# EAGLE design OxyBrain V1.2 (EAGLE 9.6.2)
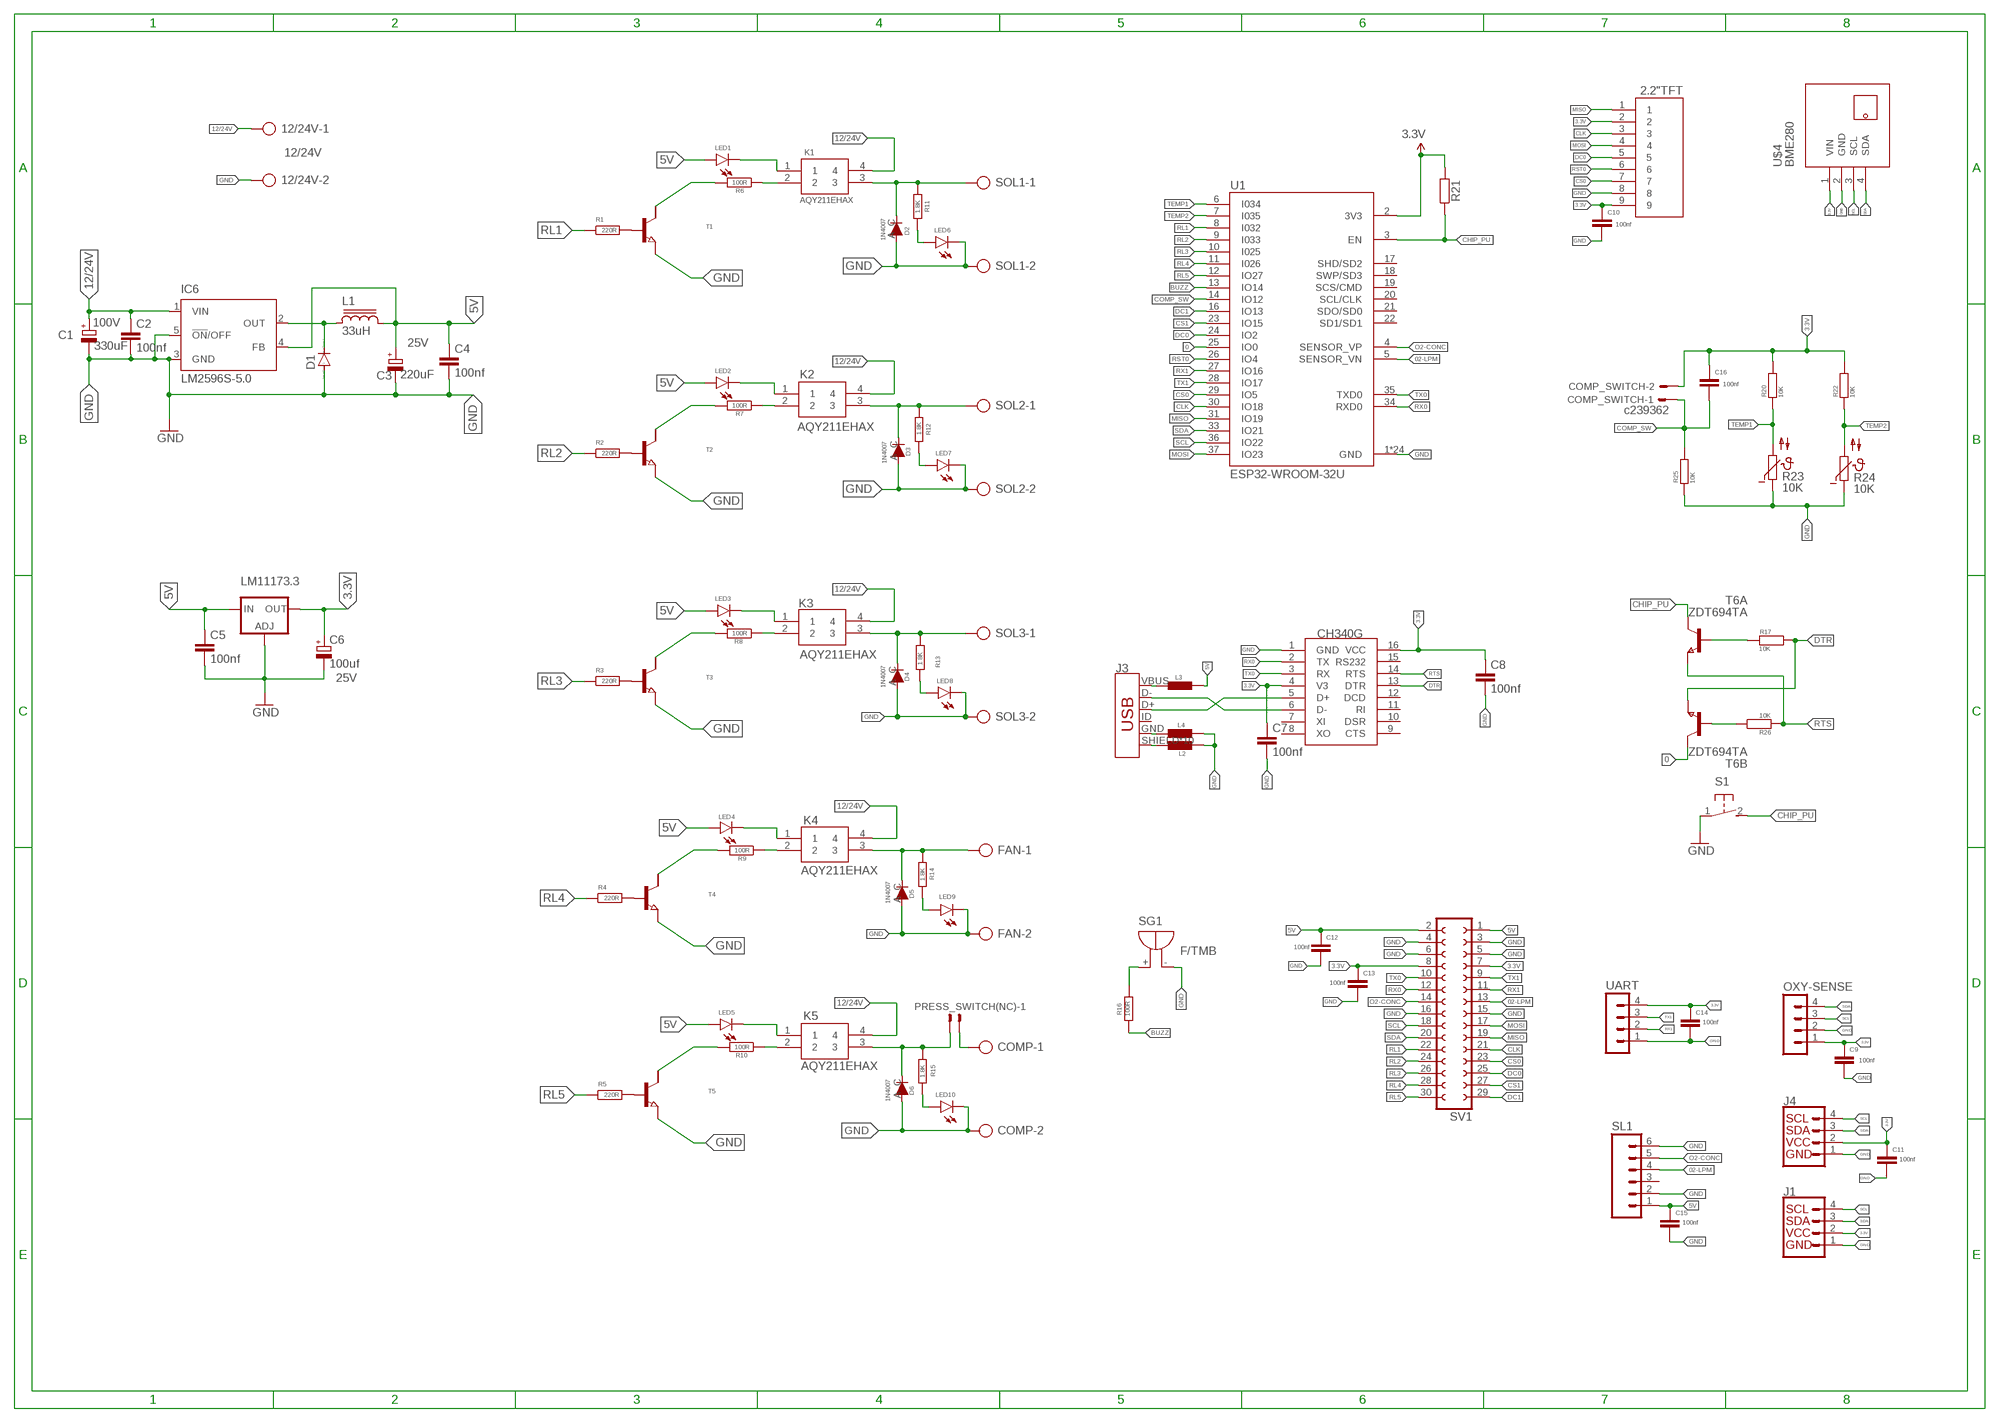
[diagram p0: schematic, sheet 1]

## Parts
2.2"TFT  1735446-9  [SHDR9W60P0X200_1X9_2000X520X63]
12/24V  12/24V  AK500/2  [AK500/2]
C1  330uF  CPOL-EU140CLH-1010  [140CLH-1010]
C2  100nf  C-EUC1206  [C1206]
C3  220uF  CPOL-EU153CLV-0605  [153CLV-0605]
C4  100nf  C-EUC1206  [C1206]
C5  100nf  C-EUC1206  [C1206]
C6  100uf  CPOL-EU153CLV-0605  [153CLV-0605]
C7  100nf  C-EUC1206  [C1206]
C8  100nf  C-EUC1206  [C1206]
C9  100nf  C-EUC1206  [C1206]
C10  100nf  C-EUC1206  [C1206]
C11  100nf  C-EUC1206  [C1206]
C12  100nf  C-EUC1206  [C1206]
C13  100nf  C-EUC1206  [C1206]
C14  100nf  C-EUC1206  [C1206]
C15  100nf  C-EUC1206  [C1206]
C16  100nf  C-EUC1206  [C1206]
COMP  AK500/2  [AK500/2]
COMP_SWITCH  c239362  22-23-2021  [22-23-2021]
D1  DIODE-SOD123  [SOD123]
D2  1N4007  1N4007_SMDSOD123-FL  [SOD-123FL]
D3  1N4007  1N4007_SMDSOD123-FL  [SOD-123FL]
D4  1N4007  1N4007_SMDSOD123-FL  [SOD-123FL]
D5  1N4007  1N4007_SMDSOD123-FL  [SOD-123FL]
D6  1N4007  1N4007_SMDSOD123-FL  [SOD-123FL]
FAN  AK500/2  [AK500/2]
IC6  LM2596S-5.0  LM2596S  [TO263-5]
J1  I2C_STANDARD  [1X04]
J3  USB_MICRO-B_HALF_PTH_MILL  [USB-MICROB-PTH-MILL]
J4  I2C_STANDARD  [1X04]
K1  AQY211EHAX  [AQY21(SMD_DIP)]
K2  AQY211EHAX  [AQY21(SMD_DIP)]
K3  AQY211EHAX  [AQY21(SMD_DIP)]
K4  AQY211EHAX  [AQY21(SMD_DIP)]
K5  AQY211EHAX  [AQY21(SMD_DIP)]
L1  33uH  CDRH127/LD  [CDRH127/LD]
L2  BLM15HD102SN1  [0402]
L3  BLM15HD102SN1  [0402]
L4  BLM15HD102SN1  [0402]
LED1  LEDCHIPLED_1206  [CHIPLED_1206]
LED2  LEDCHIPLED_1206  [CHIPLED_1206]
LED3  LEDCHIPLED_1206  [CHIPLED_1206]
LED4  LEDCHIPLED_1206  [CHIPLED_1206]
LED5  LEDCHIPLED_1206  [CHIPLED_1206]
LED6  LEDCHIPLED_1206  [CHIPLED_1206]
LED7  LEDCHIPLED_1206  [CHIPLED_1206]
LED8  LEDCHIPLED_1206  [CHIPLED_1206]
LED9  LEDCHIPLED_1206  [CHIPLED_1206]
LED10  LEDCHIPLED_1206  [CHIPLED_1206]
LM11173.3  LD117ADT33TR  [DPACK]
OXY-SENSE  MA04-1  [MA04-1]
PRESS_SWITCH(NC)  c239362  22-23-2021  [22-23-2021]
R1  220R  R-EU_M1206  [M1206]
R2  220R  R-EU_M1206  [M1206]
R3  220R  R-EU_M1206  [M1206]
R4  220R  R-EU_M1206  [M1206]
R5  220R  R-EU_M1206  [M1206]
R6  100R  R-EU_M1206  [M1206]
R7  100R  R-EU_M1206  [M1206]
R8  100R  R-EU_M1206  [M1206]
R9  100R  R-EU_M1206  [M1206]
R10  100R  R-EU_M1206  [M1206]
R11  1.8K  R-EU_M1206  [M1206]
R12  1.8K  R-EU_M1206  [M1206]
R13  1.8K  R-EU_M1206  [M1206]
R14  1.8K  R-EU_M1206  [M1206]
R15  1.8K  R-EU_M1206  [M1206]
R16  100R  R-EU_M1206  [M1206]
R17  10K  R-EU_M1206  [M1206]
R20  10K  R-EU_M1206  [M1206]
R21  10k  R-EU_M1206  [M1206]
R22  10K  R-EU_M1206  [M1206]
R23  10K  NTC640  [P640]
R24  10K  NTC640  [P640]
R25  10K  R-EU_M1206  [M1206]
R26  10K  R-EU_M1206  [M1206]
S1  B3U-1000P(M)-B  DTSM-3  [DTSM-3]
SG1  F/TMB  [F/TMB]
SL1  M06  [06P]
SOL1  AK500/2  [AK500/2]
SOL2  AK500/2  [AK500/2]
SOL3  AK500/2  [AK500/2]
SV1  FE15-2  [FE15-2]
T1  600mA/40V  NPN-TRANSISTIOR-2COLSOT89  [SOT89]
T2  600mA/40V  NPN-TRANSISTIOR-2COLSOT89  [SOT89]
T3  600mA/40V  NPN-TRANSISTIOR-2COLSOT89  [SOT89]
T4  600mA/40V  NPN-TRANSISTIOR-2COLSOT89  [SOT89]
T5  600mA/40V  NPN-TRANSISTIOR-2COLSOT89  [SOT89]
T6  ZDT694TA  NPN2SM8  [SM8]
U1  ESP32-WROOM-32U  [XCVR_ESP32-WROOM-32U]
U$1  CH340G  [SOIC16]
U$4  BME280  TEMP-HUM-PRES-BME280  [TEMP-HUM-PRES-BME280]
UART  MA04-1  [MA04-1]

## Nets
0: T6.7(B:C) T6.8(B:C) U1.25(IO0)
02-LPM: SL1.4 SV1.13 U1.5(SENSOR_VN)
3.3V: 2.2"TFT.2 2.2"TFT.9 C6.+ C7.1 C8.1 C9.1 C10.1 C11.1 C13.1 C14.1 C16.1 COMP_SWITCH.2 J1.2 J4.2 LM11173.3.4(OUT) OXY-SENSE.1 R20.1 R21.2 R22.1 SV1.7 SV1.8 U1.2(3V3) U$1.4(V3) U$1.16(VCC) U$4.1(VIN) UART.4
5V: C3.+ C4.1 C5.1 C12.1 C15.1 IC6.4(FB) L1.2 L3.2 LED1.A LED2.A LED3.A LED4.A LED5.A LM11173.3.3(IN) SL1.1 SV1.1 SV1.2
12/24V: 12/24V.1 C1.+ C2.1 IC6.1(VIN) K1.4 K2.4 K3.4 K4.4 K5.4
BUZZ: R16.1 U1.13(IO14)
CHIP_PU: R21.1 S1.2 T6.5(A:C) T6.6(A:C) U1.3(EN)
CLK: 2.2"TFT.3 SV1.21 U1.30(IO18)
COMP1: COMP.1 PRESS_SWITCH(NC).2
COMP_ON1: D6.C(K) K5.3 PRESS_SWITCH(NC).1 R15.1
COMP_SW: C16.2 COMP_SWITCH.1 R25.1 U1.14(IO12)
CS0: 2.2"TFT.7 SV1.23 U1.29(IO5)
CS1: SV1.27 U1.23(IO15)
DC0: 2.2"TFT.5 SV1.25 U1.24(IO2)
DC1: SV1.29 U1.16(IO13)
DTR: R17.1 T6.1(B:E) U$1.13(DTR)
GND: 2.2"TFT.8 12/24V.2 C1.- C2.2 C3.- C4.2 C5.2 C6.- C7.2 C8.2 C9.2 C10.2 C11.2 C12.2 C13.2 C14.2 C15.2 COMP.2 D1.A D2.A D3.A D4.A D5.A D6.A FAN.2 IC6.3(GND) IC6.5(!ON!/OFF) J1.1 J4.1 L2.2 L4.2 LED6.C LED7.C LED8.C LED9.C LED10.C LM11173.3.1(ADJ) OXY-SENSE.2 R23.1 R24.1 R25.2 S1.1 SG1.- SL1.2 SL1.6 SOL1.2 SOL2.2 SOL3.2 SV1.3 SV1.4 SV1.5 SV1.6 SV1.15 SV1.16 T1.3(E) T2.3(E) T3.3(E) T4.3(E) T5.3(E) U1.1(GND) U1.15(GND) U1.38(GND) U1.G.1(GND) U1.G.2(GND) U1.G.4(GND) U1.G.5(GND) U1.G.6(GND) U1.G.7(GND) U1.G.8(GND) U1.G.9(GND) U1.G.10(GND) U1.G.11(GND) U1.G.12(GND) U1.G.13(GND) U1.G.14(GND) U1.G.15(GND) U1.G.16(GND) U1.G.17(GND) U1.G.18(GND) U1.G.19(GND) U1.G.20(GND) U1.G.21(GND) U1.G.22(GND) U$1.1(GND) U$4.2(GND) UART.1
MISO: 2.2"TFT.1 SV1.19 U1.31(IO19)
MOSI: 2.2"TFT.4 SV1.17 U1.37(IO23)
N$1: K1.2 R6.1
N$2: K2.2 R7.1
N$3: D3.C(K) K2.3 R12.1 SOL2.1
N$4: K2.1 LED2.C
N$5: K1.1 LED1.C
N$6: R2.2 T2.1(B)
N$7: R7.2 T2.2(C)
N$8: K3.1 LED3.C
N$9: D2.C(K) K1.3 R11.1 SOL1.1
N$10: K4.1 LED4.C
N$11: LED7.A R12.2
N$12: K3.2 R8.1
N$13: R1.2 T1.1(B)
N$14: D4.C(K) K3.3 R13.1 SOL3.1
N$15: R3.2 T3.1(B)
N$16: R8.2 T3.2(C)
N$17: R6.2 T1.2(C)
N$19: J3.VBUS L3.1
N$20: R16.2 SG1.+
N$21: R5.2 T5.1(B)
N$22: R10.2 T5.2(C)
N$23: R17.2 T6.4(A:B)
N$25: R26.1 T6.2(B:B)
N$26: K4.2 R9.1
N$27: LED10.A R15.2
N$28: LED6.A R11.2
N$29: K5.1 LED5.C
N$30: LED8.A R13.2
N$31: K5.2 R10.1
N$32: D5.C(K) FAN.1 K4.3 R14.1
N$33: R4.2 T4.1(B)
N$34: R9.2 T4.2(C)
N$36: J3.GND L4.1
N$37: LED9.A R14.2
N$38: J3.SHIELD J3.SHIELD2(SHIELD) J3.SHIELD3(SHIELD) J3.SHIELD4(SHIELD) J3.SHIELD5(SHIELD) J3.SHIELD6(SHIELD) J3.SHIELD7(SHIELD) J3.SHIELD8(SHIELD) J3.SHIELD9(SHIELD) J3.SHIELD10(SHIELD) L2.1
N$40: J3.D- U$1.6(D-)
N$41: J3.D+ U$1.5(D+)
O2-CONC: SL1.5 SV1.14 U1.4(SENSOR_VP)
OUT: D1.C IC6.2(OUT) L1.1
RL1: R1.1 SV1.22 U1.8(I032)
RL2: R2.1 SV1.24 U1.9(I033)
RL3: R3.1 SV1.26 U1.10(I025)
RL4: R4.1 SV1.28 U1.11(I026)
RL5: R5.1 SV1.30 U1.12(IO27)
RST0: 2.2"TFT.6 U1.26(IO4)
RTS: R26.2 T6.3(A:E) U$1.14(RTS)
RX0: SV1.12 U1.34(RXD0) U$1.2(TX)
RX1: SV1.11 U1.27(IO16) UART.2
SCL: J1.4 J4.4 OXY-SENSE.3 SV1.18 U1.36(IO22) U$4.3(SCL)
SDA: J1.3 J4.3 OXY-SENSE.4 SV1.20 U1.33(IO21) U$4.4(SDA)
TEMP1: R20.2 R23.2 U1.6(I034)
TEMP2: R22.2 R24.2 U1.7(I035)
TX0: SV1.10 U1.35(TXD0) U$1.3(RX)
TX1: SV1.9 U1.28(IO17) UART.3
Unconnected: J3.ID SL1.3 T1.2@1(C/) T2.2@1(C/) T3.2@1(C/) T4.2@1(C/) T5.2@1(C/) U1.17(SHD/SD2) U1.18(SWP/SD3) U1.19(SCS/CMD) U1.20(SCL/CLK) U1.21(SDO/SD0) U1.22(SD1/SD1) U$1.7(XI) U$1.8(XO) U$1.9(CTS) U$1.10(DSR) U$1.11(RI) U$1.12(DCD) U$1.15(RS232)

## Library data of the parts
2.2"TFT = SamacSys_Parts:1735446-9: TE Connectivity 1735446, 9 Way, 1 Row, Straight PCB Header Source: Datasheet <https://www.te.com/commerce/DocumentDelivery/DDEController?Action=srchrtrv&DocNm=1735446&DocType=Customer Drawing&DocLang=English&PartCntxt=1735446-9&DocFormat=pdf>; DESCRIPTION: TE Connectivity 1735446, 9 Way, 1 Row, Straight PCB Header; HEIGHT: 6.37mm; MANUFACTURER_NAME: TE Connectivity; MANUFACTURER_PART_NUMBER: 1735446-9; MOUSER_PART_NUMBER: 571-1735446-9; MOUSER_PRICE-STOCK: https://www.mouser.co.uk/ProductDetail/TE-Connectivity-AMP/1735446-9?qs=fvVej%2FMj3jdUVnaxOnahuA%3D%3D
12/24V COMP FAN SOL1-SOL3 = con-ptr500:AK500/2: CONNECTOR; OC_FARNELL: unknown; OC_NEWARK: unknown
C1 = rcl:CPOL-EU: POLARIZED CAPACITOR, European symbol; SPICEPREFIX: C; VOLTAGE: 100V
C2 C4 C5 C7-C16 = rcl:C-EU: CAPACITOR, European symbol; SPICEPREFIX: C
C3 C6 = rcl:CPOL-EU: POLARIZED CAPACITOR, European symbol; SPICEPREFIX: C; VOLTAGE: 25V
COMP_SWITCH PRESS_SWITCH(NC) = con-molex:22-23-2021: .100" (2.54mm) Center Header - 2 Pin; MF: MOLEX; MPN: 22-23-2021; OC_FARNELL: 1462926; OC_NEWARK: 25C3832
D1 = diode:DIODE-: DIODE
D2-D6 = 1N4007_SOD123FL:1N4007_SMD: RECTIFIER, 1KV, 1A, DO-214AC ROHS COMPLIANT: YES Source: Datasheet <https://componentsearchengine.com/Datasheets/2/1N4007 SMD.pdf>
IC6 = national-semiconductor:LM2596: SIMPLE SWITCHER® Power Converter 150 kHz 3A Step-Down Voltage Regulator Source: http://www.national.com/ds/LM/LM2596.pdf; MF: NATIONAL SEMICONDUCTOR; MPN: LM2596S-ADJ/NOPB; OC_FARNELL: 9494367; OC_NEWARK: 41K3842
J1 J4 = SparkFun-Connectors:I2C_STANDARD: SparkFun I2C Standard Pinout Header SparkFun has standardized on a pinout for all I2C based sensor breakouts. This pinout allows I2C boards to be plugged directly into the headers on Arduino Uno compatible boards, and to be daisy chained easily. Example SparkFun Products: SparkFun Atmospheric Sensor Breakout - BME280 <https://www.sparkfun.com/products/13676> SparkFun Altitude/Pressure Sensor Breakout - MPL3115A2 <https://www.sparkfun.com/products/11084> SparkFun TOF Range Finder Sensor - VL6180 <https://www.sparkfun.com/products/12785>
J3 = SparkFun-Connectors:USB_MICRO-B: USB Type Micro-B Connector Male/female and PTH/SMT variants SparkFun Products: SparkFun microB USB Breakout <https://www.sparkfun.com/products/12035> SparkFun USB microB Plug Breakout <https://www.sparkfun.com/products/10031> SparkFun ESP8266 Thing <https://www.sparkfun.com/products/13231>; PROD_ID: CONN-13711
K1-K5 = SamacSys_Parts:AQY211EHAX: DIP-4 pin PhotoMOS Relay Source: Datasheet <https://industrial.panasonic.com/ac/e_download/control/relay/photomos/catalog/semi_eng_ge1a_aqy21_e.pdf>; DESCRIPTION: DIP-4 pin PhotoMOS Relay; HEIGHT: mm; MANUFACTURER_NAME: Panasonic; MANUFACTURER_PART_NUMBER: AQY211EHAX; MOUSER_PART_NUMBER: 769-AQY211EHAX; MOUSER_PRICE-STOCK: https://www.mouser.co.uk/ProductDetail/Panasonic-Industrial-Devices/AQY211EHAX/?qs=wKtUvITRiam%252BWBlj1YEcNw%3D%3D
L1 = inductor-sumida:CDRH127/LD: Power Inductor
L2-L4 = inductors:BLM15H: EMIFIL (R) Chip Ferrite Bead for GHz Noise Source: http://www.murata.com/ Ferrite Bead BLM15H.pdf
LED1-LED10 = led:LED: LED OSRAM: - CHIPLED LG R971, LG N971, LY N971, LG Q971, LY Q971, LO R971, LY R971 LH N974, LH R974 LS Q976, LO Q976, LY Q976 LO Q996 - Hyper CHIPLED LW Q18S LB Q993, LB Q99A, LB R99A - SideLED LS A670, LO A670, LY A670, LG A670, LP A670 LB A673, LV A673, LT A673, LW A673 LH A674 LY A675 LS A676, LA A676, LO A676, LY A676, LW A676 LS A679, LY A679, LG A679 - Hyper Micro SIDELED® LS Y876, LA Y876, LO Y876, LY Y876 LT Y87S - SmartLED LW L88C, LW L88S LB L89C, LB L89S, LG L890 LS L89K, LO L89K, LY L89K LS L896, LA L896, LO L896, LY L896 - TOPLED LS T670, LO T670, LY T670, LG T670, LP T670 LSG T670, LSP T670, LSY T670, LOP T670, LYG T670 LG T671, LOG T671, LSG T671 LB T673, LV T673, LT T673, LW T673 LH T674 LS T676, LA T676, LO T676, LY T676, LB T676, LH T676, LSB T676, LW T676 LB T67C, LV T67C, LT T67C, LS T67K, LO T67K, LY T67K, LW E67C LS E67B, LA E67B, LO E67B, LY E67B, LB E67C, LV E67C, LT E67C LW T67C LS T679, LY T679, LG T679 LS T770, LO T770, LY T770, LG T770, LP T770 LB T773, LV T773, LT T773, LW T773 LH T774 LS E675, LA E675, LY E675, LS T675 LS T776, LA T776, LO T776, LY T776, LB T776 LHGB T686 LT T68C, LB T68C - Hyper Mini TOPLED® LB M676 - Mini TOPLED Santana® LG M470 LS M47K, LO M47K, LY M47K Source: http://www.osram.convergy.de LUXEON: - LUMILED® LXK2-PW12-R00, LXK2-PW12-S00, LXK2-PW14-U00, LXK2-PW14-V00 LXK2-PM12-R00, LXK2-PM12-S00, LXK2-PM14-U00 LXK2-PE12-Q00, LXK2-PE12-R00, LXK2-PE12-S00, LXK2-PE14-T00, LXK2-PE14-U00 LXK2-PB12-K00, LXK2-PB12-L00, LXK2-PB12-M00, LXK2-PB14-N00, LXK2-PB14-P00, LXK2-PB14-Q00 LXK2-PR12-L00, LXK2-PR12-M00, LXK2-PR14-Q00, LXK2-PR14-R00 LXK2-PD12-Q00, LXK2-PD12-R00, LXK2-PD12-S00 LXK2-PH12-R00, LXK2-PH12-S00 LXK2-PL12-P00, LXK2-PL12-Q00, LXK2-PL12-R00 Source: www.luxeon.com KINGBRIGHT: KA-3528ASYC Source: www.kingbright.com
LM11173.3 = v-reg:LD117A?*: Low drop fixed and adjustable positive voltage regulators 1 A Source: http://www.st.com/stonline/products/literature/ds/7194/ld1117axx.pdf
OXY-SENSE UART = con-lstb:MA04-1: PIN HEADER; OC_FARNELL: unknown; OC_NEWARK: unknown
R1-R17 R20-R22 R25 R26 = rcl:R-EU_: RESISTOR, European symbol; SPICEPREFIX: R
R23 R24 = ptc-ntc:NTC640: PHILIPS NTC; OC_FARNELL: unknown; OC_NEWARK: unknown
S1 = switch-tact:DTSM-3
SG1 = buzzer:F/TMB: BUZZER Source: Buerklin; OC_FARNELL: unknown; OC_NEWARK: unknown
SL1 = con-amp-quick:M06: AMP QUICK CONNECTOR; OC_FARNELL: unknown; OC_NEWARK: unknown
SV1 = con-lsta:FE15-2: FEMALE HEADER; OC_FARNELL: unknown; OC_NEWARK: unknown
T1-T5 = semicon-smd-ipc:NPN-TRANSISTIOR-2COL: NPN TRANSISTOR 2 colletor pins
T6 = zetex:NPN2SM8: Dual NPN TRANSISTOR; OC_FARNELL: unknown; OC_NEWARK: unknown
U1 = ESP32-WROOM-32U:ESP32-WROOM-32U: Wi-Fi/BT BLE Module ESP32-D0WD SPI Flash UART U.FL Conn. Check prices <https://pricing.snapeda.com/parts/ESP32-WROOM-32U/Espressif%20Systems/view-part?ref=eda>; AVAILABILITY: No availability data; DESCRIPTION: Bluetooth, WiFi 802.11b/g/n, Bluetooth v4.2 +EDR, Class 1, 2 and 3 Transceiver Module 2.4GHz ~ 2.5GHz Antenna Not Included, U.FL Surface Mount; MF: Espressif Systems; MP: ESP32-WROOM-32U; PACKAGE: Module Espressif Systems; PRICE: None
U$1 = ch340g:CH340G
U$4 = diy-modules:TEMP-HUM-PRES-BME280: Digital Humidity-Temperature-Pressure Sensor based on BME280 device More information about BME280 device is available here: https://www.bosch-sensortec.com/bst/products/all_products/bme280 Click here to find device on ebay.com <http://www.ebay.com/sch/bme280+breakout>

## Net classes
1 GND: width 0.7 mm, drill 0.635 mm, clearance 0.3 mm
2 VCC: width 0.7 mm, drill 0.635 mm, clearance 0.3 mm

## Board
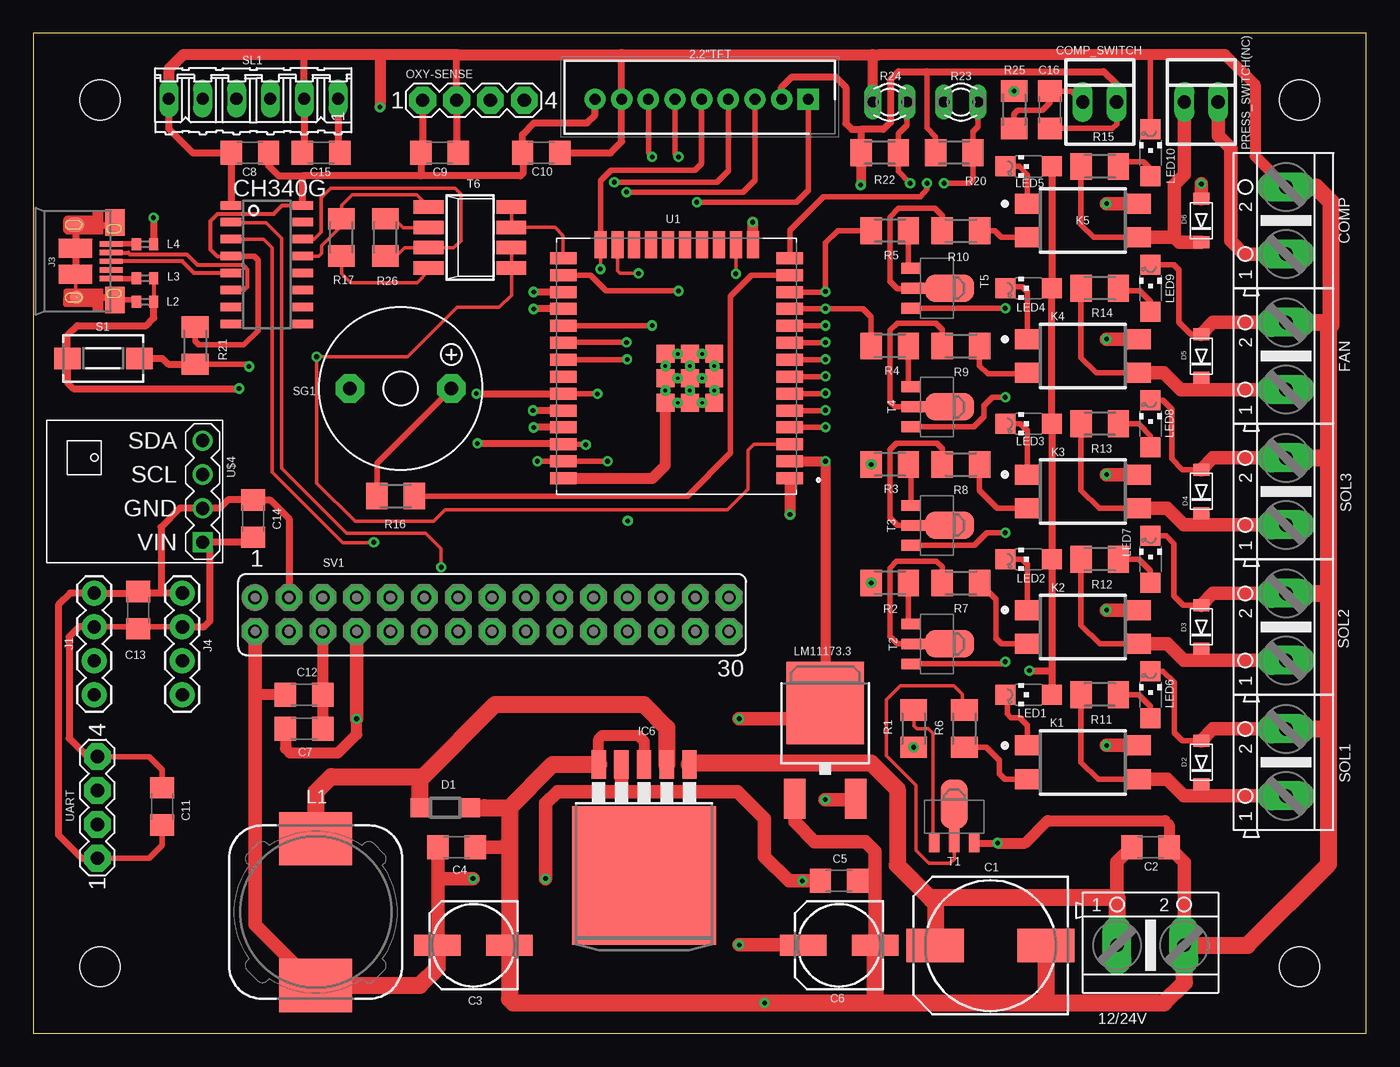
[diagram p1: board, top side]
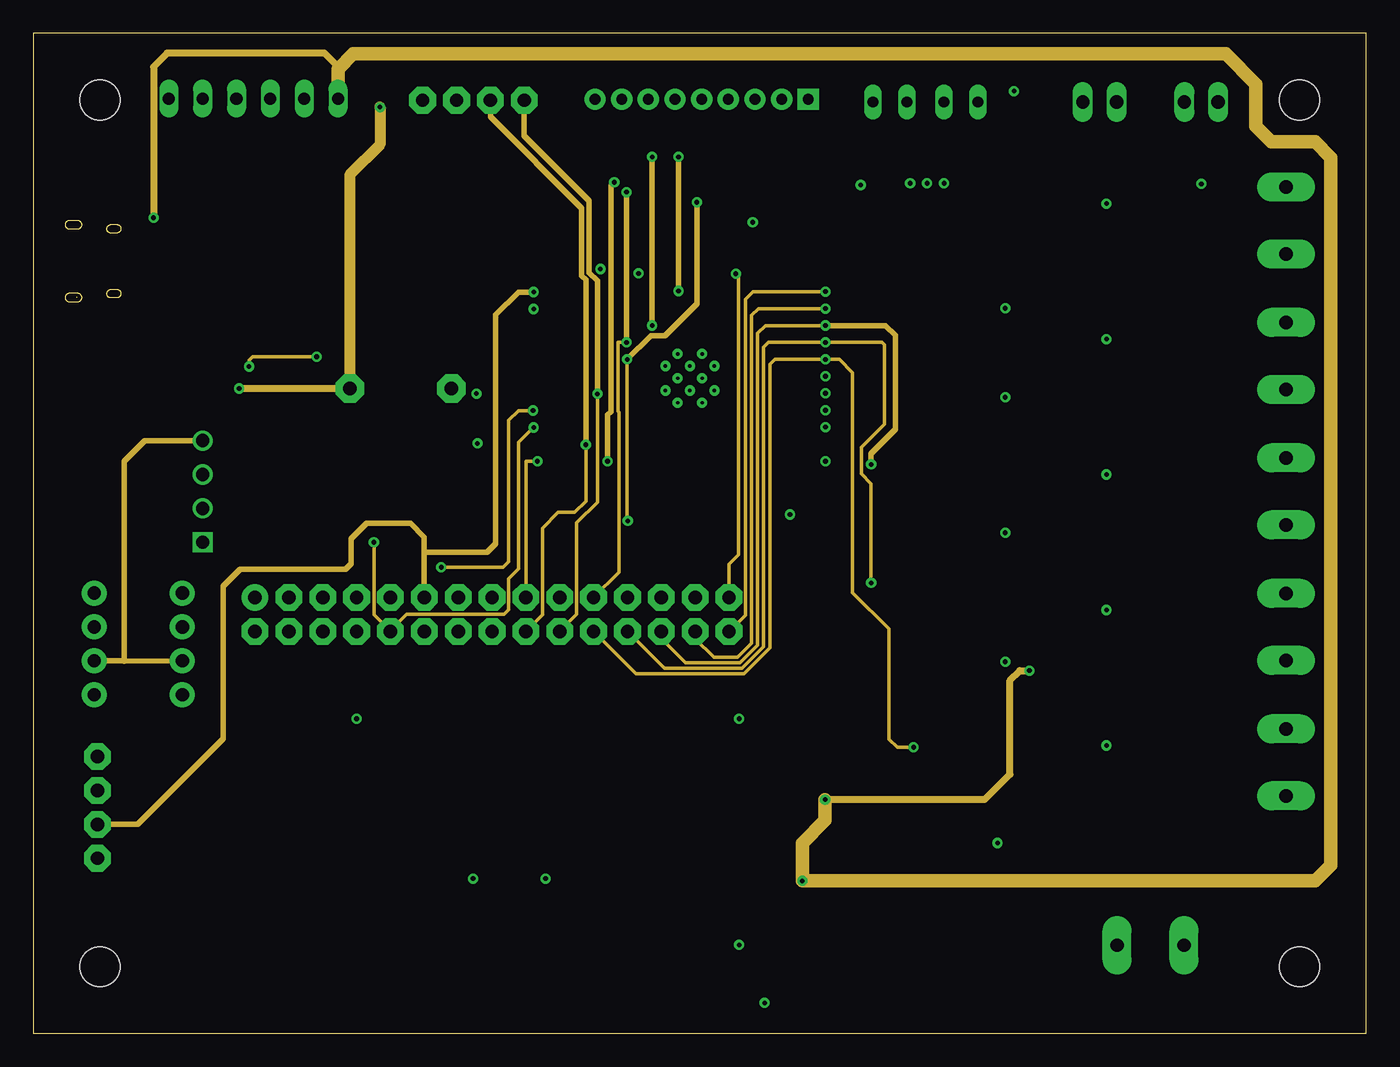
[diagram p2: board, inner layer Route2]
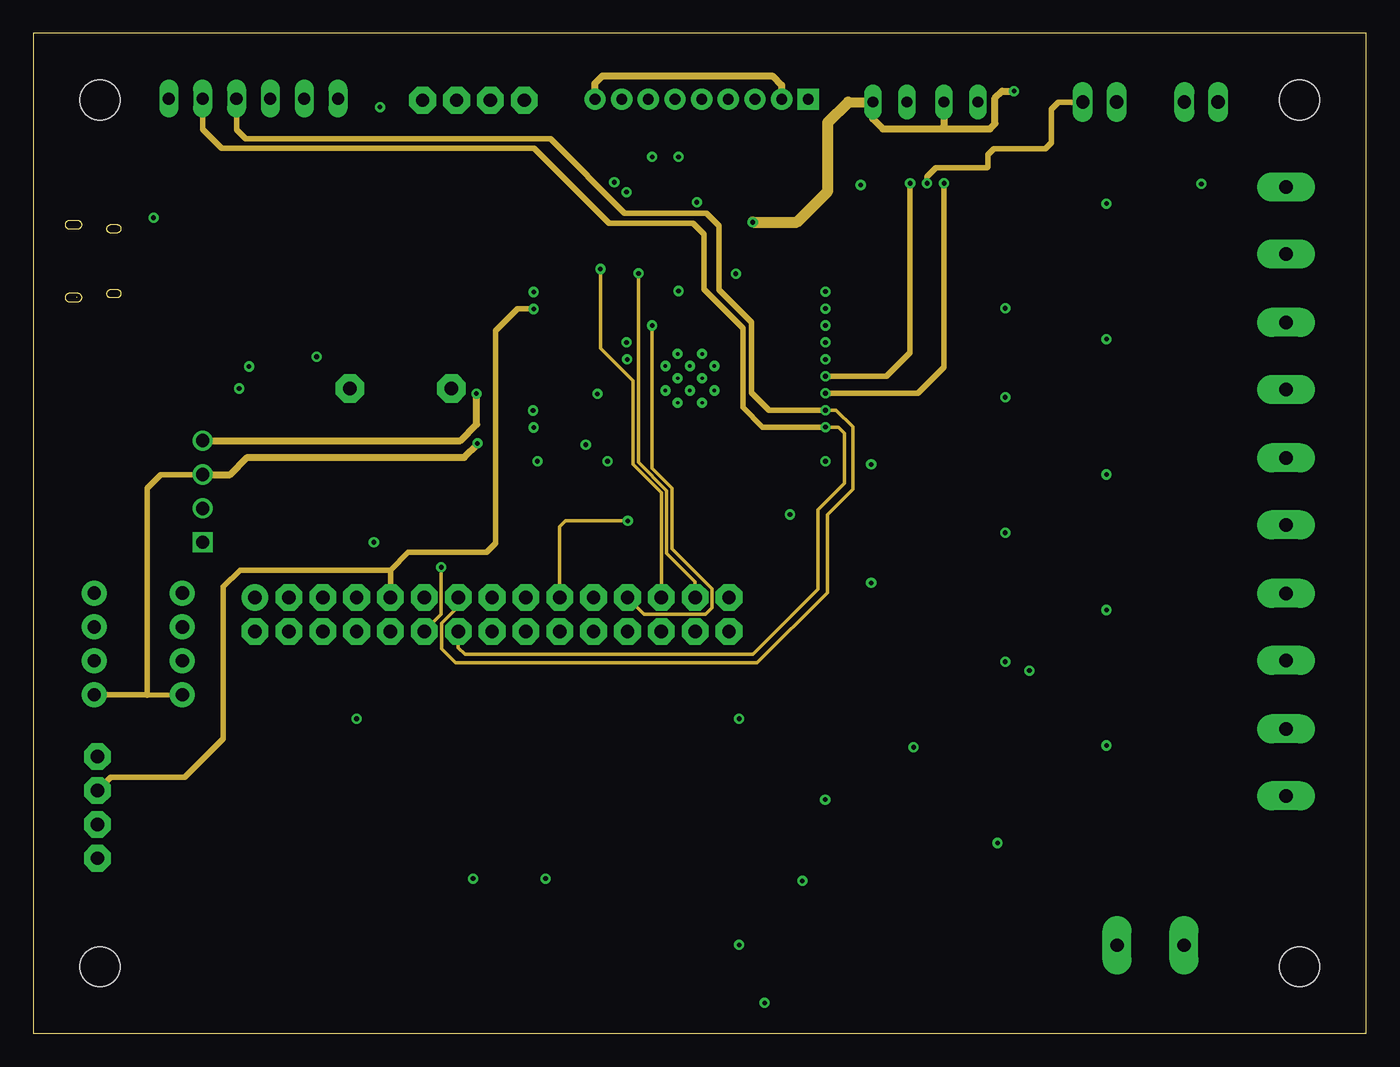
[diagram p3: board, inner layer Route15]
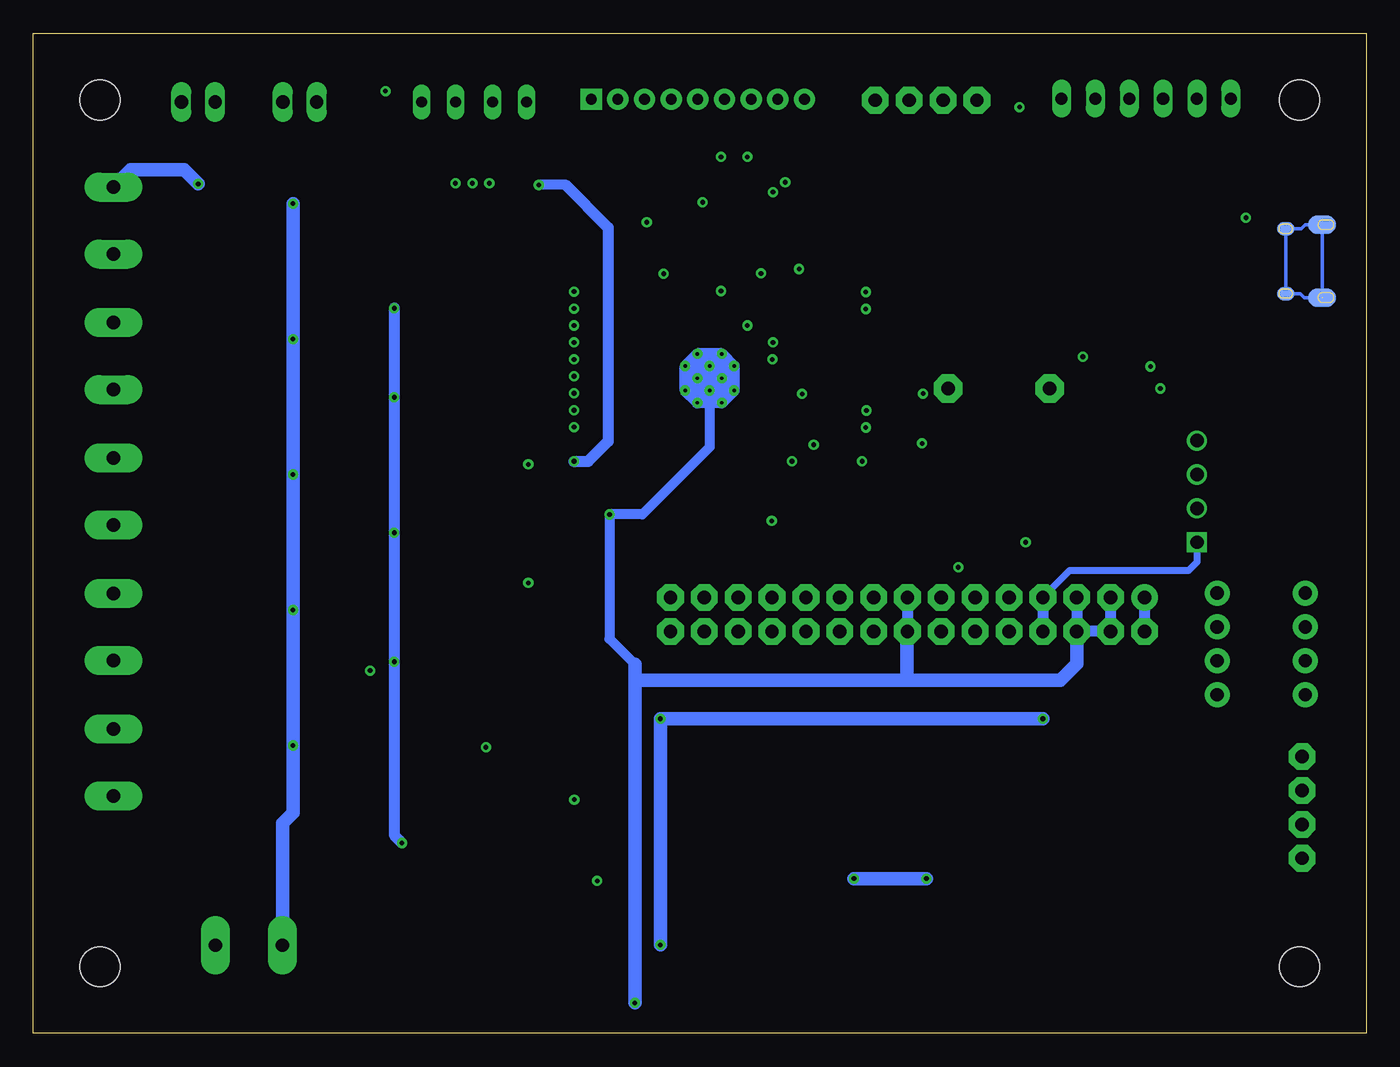
[diagram p4: board, bottom side, seen from below]

Size 100 x 75 mm. Coordinates in mm from the lower left corner, seen from the top.
Outline: 0,0 100,0 100,75 0,75 0,0
Copper layers (1+2*15+16): Top 0.035mm / dielectric 1.5mm / Route2 0.035mm / dielectric 0.15mm / Route15 0.035mm / dielectric 0.2mm / Bottom 0.035mm
Design rules "default *": minimum track width 6mil, minimum drill 0.35mm, track to track 6mil, track to pad 6mil, pad to pad 6mil, via to via 6mil, smd to smd 6mil, copper to edge 40mil, drill to drill 6mil, minimum pad ring 10mil, minimum via ring 8mil, stop-mask expansion 4mil, vias tented up to drill 0mil, thermal gap 10mil
Holes 3 mm at 5,5 95,5 95,70 5,70

### Footprints (pad centres in the part's own frame; a part is rotated, then mirrored left to right if it is on the bottom)
SHDR9W60P0X200_1X9_2000X520X63 = drill 0.8 pad 1.6 square: 1 0,0 | drill 0.8 pad 1.6: 2 -2,0; 3 -4,0; 4 -6,0; 5 -8,0; 6 -10,0; 7 -12,0; 8 -14,0; 9 -16,0
AK500/2 = drill 1 pad 2.184 long: 1 -2.515,0; 2 2.515,0
140CLH-1010 = smd 4.3 x 2.5: + 4.15,0; - -4.15,0
C1206 = smd 1.6 x 1.8: 1 -1.4,0; 2 1.4,0
153CLV-0605 = smd 3.5 x 1.6: + 2.7,0; - -2.7,0
22-23-2021 = drill 1 long: 1 -1.27,0; 2 1.27,0
SOD123 = smd 1.4 x 1.4: A 1.9,0; C -1.9,0
SOD-123FL = smd 0.91 x 1.22: A 1.637,0; C -1.637,0
TO263-5 = smd 1.067 x 2.159: 1 -3.404,-5.791; 2 -1.702,-5.791; 3 0,-5.791; 4 1.702,-5.791; 5 3.404,-5.791 | smd 10.8 x 10.41: 6 0,2.54
1X04 = drill 1 pad 1.88: 1 0,0; 2 2.54,0; 3 5.08,0; 4 7.62,0
USB-MICROB-PTH-MILL = smd 0.4 x 1.75: D+ 0,0; D- -0.65,0; GND 1.3,0; ID 0.65,0; VBUS -1.3,0 | smd 2 x 1.46: SHIELD -2.9,0.275; SHIELD2 2.9,0.275 | smd 1.425 x 2.5: SHIELD3 -0.963,-2.675; SHIELD4 0.963,-2.675 | smd 1.4 x 2.1 bottom: SHIELD5 -2.731,-2.531; SHIELD7 2.729,-2.531 | smd 1 x 1: SHIELD6 2.7,-2.575 | smd 1.1 x 1.5: SHIELD8 -2.731,-2.731 | smd 1 x 1.3 bottom: SHIELD9 -2.43,0.195; SHIELD10 2.43,0.195
AQY21(SMD_DIP) = smd 1.5 x 1.9: 1 -1.27,-4.15; 2 1.27,-4.15; 3 1.27,4.15; 4 -1.27,4.15
CDRH127/LD = smd 4 x 5.5: 1 -5.5,0; 2 5.5,0
0402 = smd 0.7 x 0.9: 1 -0.65,0; 2 0.65,0
CHIPLED_1206 = smd 1.5 x 1.5: A 0,-1.75; C 0,1.75
DPACK = smd 1.6 x 3: 1 -2.28,-4.8; 3 2.28,-4.8 | smd 5.8 x 6.2: 4 0,2.38
MA04-1 = drill 1 pad 2 octagon: 1 -3.81,0; 2 -1.27,0; 3 1.27,0; 4 3.81,0
M1206 = smd 1.6 x 2: 1 -1.4,0; 2 1.4,0
P640 = drill 0.813 long: 1 -1.27,0; 2 1.27,0
DTSM-3 = smd 2 x 1.6: 1 -2.7,0; 2 2.7,0
F/TMB = drill 1.016 pad 2.159 octagon: + 3.81,0; - -3.81,0
06P = drill 0.914 long: 1 -6.35,0; 2 -3.81,0; 3 -1.27,0; 4 1.27,0; 5 3.81,0; 6 6.35,0
FE15-2 = drill 1 pad 2: 1 -17.78,1.27 | drill 1 pad 2 octagon: 2 -17.78,-1.27; 3 -15.24,1.27; 4 -15.24,-1.27; 5 -12.7,1.27; 6 -12.7,-1.27; 7 -10.16,1.27; 8 -10.16,-1.27; 9 -7.62,1.27; 10 -7.62,-1.27; 11 -5.08,1.27; 12 -5.08,-1.27; 13 -2.54,1.27; 14 -2.54,-1.27; 15 0,1.27; 16 0,-1.27; 17 2.54,1.27; 18 2.54,-1.27; 19 5.08,1.27; 20 5.08,-1.27; 21 7.62,1.27; 22 7.62,-1.27; 23 10.16,1.27; 24 10.16,-1.27; 25 12.7,1.27; 26 12.7,-1.27; 27 15.24,1.27; 28 15.24,-1.27; 29 17.78,1.27; 30 17.78,-1.27
SOT89 = smd 0.8 x 1.4: 1 -1.499,-1.981; 3 1.499,-1.981 | smd 0.8 x 1.9: 2 0,-1.727 | smd 2.032 x 3.65: 2@1 0,0.94
SM8 = smd 1.016 x 2.235: 1 -2.286,-3.099; 2 -0.762,-3.099; 3 0.762,-3.099; 4 2.286,-3.099; 5 2.286,3.099; 6 0.762,3.099; 7 -0.762,3.099; 8 -2.286,3.099
XCVR_ESP32-WROOM-32U = smd 2 x 0.9: 1 -8.5,8.41; 2 -8.5,7.14; 3 -8.5,5.87; 4 -8.5,4.6; 5 -8.5,3.33; 6 -8.5,2.06; 7 -8.5,0.79; 8 -8.5,-0.48; 9 -8.5,-1.75; 10 -8.5,-3.02; 11 -8.5,-4.29; 12 -8.5,-5.56; 13 -8.5,-6.83; 14 -8.5,-8.1; 25 8.5,-8.1; 26 8.5,-6.83; 27 8.5,-5.56; 28 8.5,-4.29; 29 8.5,-3.02; 30 8.5,-1.75; 31 8.5,-0.48; 32 8.5,0.79; 33 8.5,2.06; 34 8.5,3.33; 35 8.5,4.6; 36 8.5,5.87; 37 8.5,7.14; 38 8.5,8.41 | smd 0.9 x 2: 15 -5.715,-9.1; 16 -4.445,-9.1; 17 -3.175,-9.1; 18 -1.905,-9.1; 19 -0.635,-9.1; 20 0.635,-9.1; 21 1.905,-9.1; 22 3.175,-9.1; 23 4.445,-9.1; 24 5.715,-9.1 | smd 1.33 x 1.33: G.1 0.835,2.745; G.2 -1,2.745; G.4 -2.835,2.745; G.5 0.835,0.91; G.6 -1,0.91; G.7 -2.835,0.91; G.8 0.835,-0.925; G.9 -1,-0.925; G.10 -2.835,-0.925 | drill 0.254: G.11 -0.083,2.745; G.12 -1.917,2.745; G.13 0.835,1.827; G.14 -1,1.827; G.15 -2.835,1.827; G.16 -0.083,0.91; G.17 -1.917,0.91; G.18 0.835,-0.007; G.19 -1,-0.007; G.20 -2.835,-0.007; G.21 -0.083,-0.925; G.22 -1.917,-0.925
SOIC16 = smd 0.635 x 1.524: 1 -4.445,-2.695; 2 -3.175,-2.695; 3 -1.905,-2.695; 4 -0.635,-2.695; 5 0.635,-2.695; 6 1.905,-2.695; 7 3.175,-2.695; 8 4.445,-2.695; 9 4.445,2.695; 10 3.175,2.695; 11 1.905,2.695; 12 0.635,2.695; 13 -0.635,2.695; 14 -1.905,2.695; 15 -3.175,2.695; 16 -4.445,2.695
TEMP-HUM-PRES-BME280 = drill 1 square: 1 -5.08,3.81 | drill 1: 2 -5.08,1.27; 3 -5.08,-1.27; 4 -5.08,-3.81

### Placement (x,y rotation side)
2.2"TFT  58.14,70.05 0 top
12/24V  83.82,6.6 0 top
C1  71.82,6.58 180 top
C2  83.82,13.97 0 top
C3  33.02,6.6 180 top
C4  31.75,13.97 0 top
C5  60.45,11.43 0 top
C6  60.45,6.6 180 top
C7  20.32,22.86 0 top
C8  16.26,66.04 180 top
C9  30.48,66.04 0 top
C10  38.1,66.04 0 top
C11  9.68,17.02 270 top
C12  20.32,25.4 0 top
C13  7.87,31.75 90 top
C14  16.51,38.61 90 top
C15  21.59,66.04 180 top
C16  76.28,69.26 90 top
COMP  93.98,60.96 90 top
COMP_SWITCH  80.01,69.85 0 top
D1  30.91,16.92 0 top
D2  87.63,20.32 90 top
D3  87.63,30.48 90 top
D4  87.63,40.64 90 top
D5  87.63,50.8 90 top
D6  87.63,60.96 90 top
FAN  93.98,50.8 90 top
IC6  45.82,14.38 180 top
J1  4.57,33.02 270 top
J3  5.84,57.91 270 top
J4  11.18,33.02 270 top
K1  78.74,20.32 270 top
K2  78.74,30.48 270 top
K3  78.74,40.64 270 top
K4  78.74,50.8 270 top
K5  78.74,60.96 270 top
L1  21.18,9.09 270 top
L2  8.38,54.86 0 top
L3  8.38,59.18 0 top
L4  8.38,56.64 0 top
LED1  74.68,25.4 90 top
LED2  74.68,35.56 90 top
LED3  74.68,45.72 90 top
LED4  74.68,55.88 90 top
LED5  74.68,65.02 90 top
LED6  83.82,25.4 0 top
LED7  83.82,35.56 0 top
LED8  83.82,45.72 0 top
LED9  83.82,55.88 0 top
LED10  83.82,66.04 0 top
LM11173.3  59.41,22.4 0 top
OXY-SENSE  33.02,69.98 0 top
PRESS_SWITCH(NC)  87.63,69.85 0 top
R1  66.04,22.86 90 top
R2  64.26,33.78 0 top
R3  64.26,42.67 0 top
R4  64.26,51.56 0 top
R5  64.26,60.2 0 top
R6  69.85,22.86 90 top
R7  69.6,33.78 180 top
R8  69.6,42.67 180 top
R9  69.6,51.56 180 top
R10  69.6,60.2 180 top
R11  80.01,25.4 0 top
R12  80.01,35.56 0 top
R13  80.01,45.72 0 top
R14  80.01,55.88 0 top
R15  80.01,65.02 0 top
R16  27.18,40.31 180 top
R17  23.11,59.69 270 top
R20  69.09,66.04 0 top
R21  12.14,51.58 90 top
R22  63.5,66.04 0 top
R23  69.6,69.85 0 top
R24  64.26,69.85 0 top
R25  73.58,69.26 90 top
R26  26.42,59.69 270 top
S1  5.26,50.62 0 top
SG1  27.56,48.36 0 top
SL1  16.51,70.1 180 top
SOL1  93.98,20.32 90 top
SOL2  93.98,30.48 90 top
SOL3  93.98,40.64 90 top
SV1  34.42,31.42 0 top
T1  69.09,16.26 0 top
T2  67.82,29.21 270 top
T3  67.82,38.1 270 top
T4  67.82,46.99 270 top
T5  67.82,55.88 270 top
T6  32.77,59.69 270 top
U1  48.26,50.04 180 top
U$1  17.53,57.66 270 top
U$4  7.62,40.64 180 top
UART  4.8,16.94 90 top

### Tracks (layer width: path | path; a pad name or v marks a point on that pad's centre or on a via)
0
  Top 0.254: T6.8 T6.7 39.14,60.45 39.76,59.83 U1.25
02-LPM  (via drill 0.35)
  Top 0.406: U1.5 59.41,46.71 v59.44,46.74
  Route15 0.254: SV1.13 31.88,32 30.63,30.76 30.63,28.85 31.7,27.79 54.3,27.79 59.56,33.05 59.56,38.89 61.49,40.82 61.49,45.48 60.24,46.74 v59.44,46.74
  Route15 0.406: SL1.4 15.24,67.77 15.93,67.08 38.81,67.08 44.37,61.52 50.49,61.52 51.44,60.58 51.44,55.75 53.87,53.31 53.87,48.03 55.18,46.72 59.42,46.72 v59.44,46.74
3.3V  (via drill 0.35)
  Top 0.305: U$1.4 13.79,58.29 13.3,58.78 13.3,60.94 13.83,61.47 18.03,61.47 18.67,62.1 U$1.16
  Top 0.406: UART.4 8.71,20.75 9.68,19.79 C11.1 | J1.2 7.74,30.48 | 7.74,30.48 C13.1 | J4.2 7.74,30.48 | 67.03,72.14 67.03,67.92 67.69,67.26 R20.1 | COMP_SWITCH.2 81.28,68.17 80.97,67.86 C16.1 | R21.2 12.14,51.89 12.39,51.64 15.8,51.64 16.87,52.7 16.87,57.99 16.56,58.29 U$1.4
  Top 0.508: 2.2"TFT.2 56.14,70.95 56.92,71.73 60.2,71.73 60.96,70.97 60.96,68.25 61.41,67.79 62.1,67.79 | UART.4 4.06,20.75 2.69,22.12 2.69,29.74 3.43,30.48 J1.2 | COMP_SWITCH.2 81.28,71.17 80.31,72.14 67.03,72.14 64.92,72.14 64.31,71.53 64.31,68.33 63.78,67.79 62.1,67.79 | 20.22,64.31 18.41,64.31 17.66,65.07 C8.1 | U$1.16 20.22,64.31 | OXY-SENSE.1 29.21,66.17 C9.1 29.08,64.33 29.06,64.31 | J4.2 12.8,30.48 13.26,30.94 13.26,36.27 U$4.1 16.13,36.83 C14.1 | 29.06,64.31 36.55,64.31 36.75,64.52 36.75,65.99 C10.1 36.7,67.41 37.57,68.28 41.55,68.28 42.14,68.86 2.2"TFT.9 | 29.06,64.31 20.22,64.31 | 62.1,67.79 R22.1
  Top 0.762: U1.2 v59.44,42.9 59.44,24.81 LM11173.3.4 | R22.1 62.1,63.65 v62.08,63.63
  Top 0.813: C7.1 18.92,21.36 19.25,21.03 22.86,21.03 24.26,22.43 v24.26,23.6
  Top 1.016: 59.25,24.78 LM11173.3.4 58.22,23.6 v52.96,23.6 | v52.96,6.63 57.73,6.63 C6.+ | v24.26,23.6 SV1.8
  Route15 0.508: 2.2"TFT.9 42.14,71.25 42.7,71.81 55.45,71.81 56.14,71.11 2.2"TFT.2
  Bottom 0.508: U$4.1 12.7,35.33 13.34,34.7 22.25,34.7 SV1.7
  Bottom 0.762: 60.07,63.63 v62.08,63.63
  Bottom 0.813: SV1.7 SV1.8 | 60.07,63.63 56.87,60.43 56.87,44.4 58.37,42.9 v59.44,42.9
  Bottom 1.016: v52.96,6.63 v52.96,23.6 v24.26,23.6
5V  (via drill 0.35)
  Top 0.254: LED4.A 76.43,56.01 | LED5.A 76.43,64.92 | LED3.A 76.43,45.8
  Top 0.508: 61.77,17.53 LM11173.3.3 | v9.02,61.16 9.02,59.2 L3.2 | SL1.1 22.86,66.17 C15.1 | 76.43,64.92 76.43,56.01 76.43,45.8 LED2.A 76.43,27.23 | 76.43,27.23 LED1.A | v74.73,27.2 76.4,27.2 76.43,27.23
  Top 0.813: C12.1 16.64,25.4
  Top 1.016: v38.43,11.61 38.43,17.25 39.32,18.14 44.09,18.14 | 44.09,18.14 52.83,18.14 54.86,16.1 54.86,13.26 56.69,11.43 v57.69,11.43 C5.1 | IC6.4 44.12,18.16 44.09,18.14 | SV1.2 16.64,25.4 16.64,8.14 L1.2 | 30.33,13.95 C4.1 30.35,11.61 | v59.41,17.53 61.77,17.53 | 30.35,11.61 30.35,6.63 C3.+ | v32.99,11.61 30.35,11.61
  Top 1.27: L1.2 28.99,3.59 30.32,4.92 C3.+ 30.33,6.61
  Route2 0.508: v59.41,17.53 71.37,17.53 73.28,19.43 73.28,26.47 74.02,27.2 v74.73,27.2 | SL1.1 22.86,72.49 21.84,73.51 10.03,73.51 9.02,72.49 v9.02,61.16
  Route2 1.016: v59.41,17.53 59.41,15.98 57.69,14.26 v57.69,11.43 96.19,11.43 97.36,12.6 97.36,65.66 96.16,66.85 92.89,66.85 91.72,68.02 91.72,71.2 89.46,73.46 24,73.46 22.86,72.31 SL1.1
  Bottom 0.813: SV1.1 SV1.2
  Bottom 1.016: v38.43,11.61 v32.99,11.61
12/24V  (via drill 0.35)
  Top 1.016: v80.52,62.23 K5.4 | v80.52,31.75 K2.4 | v80.52,41.91 K3.4 | v80.52,52.07 K4.4 | v80.52,21.59 K1.4 | C2.1 81.31,12.86 81.31,10.16
  Top 1.27: 12/24V.1 81.31,10.16 67.28,10.16 | IC6.1 49.33,20.27 62.87,20.27 64.82,18.31 64.82,12.62 67.28,10.16 | C1.+ 67.67,9.78 67.28,10.16
  Bottom 1.016: v80.52,62.23 v80.52,52.07 v80.52,41.91 v80.52,31.75 v80.52,21.59 80.52,16.54 81.31,15.75 12/24V.1
BUZZ
  Top 0.406: U1.13 53.9,56.87 52.32,55.3 52.32,43.54 49.07,40.28 28.61,40.28 R16.1
CHIP_PU  (via drill 0.35)
  Top 0.254: U1.3 54.07,44.17 53.62,43.71 53.62,40.79 52.09,39.27 30.91,39.27 30.05,38.41 24.13,38.41 21.26,41.27 v21.26,50.75 28.09,50.75 31.8,54.46 34.95,54.46 35.87,55.37 T6.5 T6.6
  Top 0.406: 12.11,50.22 R21.1 16.01,50.18 v16.18,50.01
  Top 0.508: S1.2 9.68,50.62 10.12,50.18 R21.1
  Route2 0.254: v21.26,50.75 16.46,50.75 16.18,50.47 v16.18,50.01
CLK  (via drill 0.35)
  Top 0.406: v44.5,63.09 53.24,63.09 54.14,64 2.2"TFT.3 | v44.5,51.82 39.79,51.82 U1.30
  Route2 0.254: v44.5,51.82 43.87,51.82 43.87,46.65 43.94,46.57 43.94,34.59 SV1.21
  Route2 0.406: v44.5,63.09 v44.5,51.82
COMP1
  Top 1.016: PRESS_SWITCH(NC).2 88.9,67.31 89.84,66.37 89.84,59.44 90.83,58.45 COMP.1
COMP_ON1
  Top 0.406: 83.31,59.69 79.55,59.69 78.61,60.63 R15.1
  Top 1.016: K5.3 83.31,59.69 85.6,59.69 | PRESS_SWITCH(NC).1 86.36,64.39 85.6,63.63 85.6,59.69 | D6.C 85.97,59.32 85.6,59.69
COMP_SW  (via drill 0.35)
  Top 0.406: v67.06,63.75 67.06,63.32 66.56,62.74 59.28,62.74 56.76,60.22 U1.14 | COMP_SWITCH.1 77.93,70.66 C16.2 76.28,69.78 75.72,69.23 73.88,69.23 73.58,68.94 R25.1
  Route15 0.406: v67.06,63.75 67.06,64.26 67.72,64.92 71.53,64.92 71.6,65 71.6,65.89 72.06,66.34 75.92,66.34 76.38,66.8 76.38,69.32 76.91,69.85 COMP_SWITCH.1
CS0  (via drill 0.35)
  Top 0.406: v46.43,53.09 39.79,53.09 U1.29 | 2.2"TFT.7 46.14,66.03 v46.43,65.73
  Route2 0.406: v46.43,65.73 v46.43,53.09
  Route15 0.254: v46.43,53.09 46.43,42.37 47.93,40.88 47.93,36.35 50.93,33.35 50.93,31.93 50.44,31.45 45.82,31.45 SV1.23
CS1  (via drill 0.35)
  Top 0.254: U1.23 43.81,57.2 44.02,57 v45.41,57
  Route15 0.254: v45.41,57 45.41,42.82 47.52,40.71 47.52,35.99 49.66,33.86 SV1.27
DC0  (via drill 0.35)
  Top 0.254: U1.24 v42.55,57.33
  Top 0.406: U1.24 42.55,63.93 43.33,64.72 49.63,64.72 50.14,65.23 2.2"TFT.5
  Route15 0.254: v42.55,57.33 42.55,51.38 44.98,48.95 44.98,42.67 47.12,40.54 SV1.25
DC1  (via drill 0.35)
  Top 0.254: U1.16 v52.7,56.97
  Route2 0.254: v52.7,56.97 52.91,56.77 52.91,35.89 52.2,35.18 SV1.29
DTR
  Top 0.254: U$1.13 21.41,58.29 21.64,58.52 21.64,59.08 23.11,60.55 R17.1 23.11,62.1 23.9,62.89 28.75,62.89 T6.1
GND  (via drill 0.35)
  Top 0.305: L4.2 L2.2
  Top 0.406: 83.3,73.39 83.31,73.41 | U$1.1 14.91,62.18 | UART.1 8.71,13.13 9.68,14.1 C11.2 | 7.74,33.02 C13.2 8,33.02 | LED10.C 83.82,73.36 83.87,73.41 | v72.92,27.86 72.77,27.71 T2.3 | T3.3 70.61,36.6 71.55,37.54 v72.92,37.54 | T4.3 70.56,45.49 71.32,46.25 71.32,47.07 71.96,47.7 v72.92,47.7 | T5.3 v72.92,54.38 | v72.92,54.38 | LED9.C 85.58,57.63 85.95,57.25 85.95,53.34 86.86,52.44 D5.A | LED8.C 84.76,47.47 85.42,46.81 85.42,43.08 86.22,42.28 D4.A | LED7.C 84.99,37.31 85.57,36.73 85.57,32.82 86.27,32.12 D3.A | LED6.C 84.76,27.15 85.6,26.31 85.6,22.55 86.2,21.96 D2.A
  Top 0.508: 20.27,73.4 20.32,73.35 SL1.2 20.32,66.17 C15.2 | 44.12,73.4 44.14,73.38 2.2"TFT.8 44.14,66.87 43.31,66.04 C10.2 | UART.1 3.63,13.13 1.88,14.88 1.88,32.13 2.77,33.02 J1.1 8,33.02 9.58,33.02 | L2.2 9.03,53.66 8.46,53.09 3.3,53.09 2.56,52.34 S1.1 2.56,48.8 3,48.36 v15.44,48.36 | 14.83,65.89 C8.2 | SL1.6 10.16,67.84 11.96,66.04 C8.2 | C9.2 31.75,66.06 OXY-SENSE.2 31.75,73.37 31.77,73.4 | C8.2 14.86,62.13 U$1.1 | 9.58,33.02 9.58,37.97 11,39.4 12.68,39.4 U$4.2 13.97,39.37 14.61,40.01 C14.2 17.75,40.01 19.18,38.58 SV1.3 | J4.1 9.58,33.02 | T1.3 v72.34,14.28 | v72.34,14.28 | R25.2 72.97,70.66 | 33.83,16.92 D1.A
  Top 0.762: U1.G.6 U1.G.16 U1.G.5 | U1.G.18 U1.G.8 U1.G.21 U1.G.9 | U1.G.7 U1.G.17 U1.G.6 | U1.G.9 U1.G.19 U1.G.6 | U1.G.6 U1.G.14 U1.G.2 | U1.G.7 U1.G.15 U1.G.4 U1.G.12 U1.G.2 | U1.G.13 U1.G.1 U1.G.11 U1.G.2 | U1.G.9 U1.G.22 U1.G.10 U1.G.20 U1.G.7 | R24.1 62.99,73.4
  Top 0.813: 63.52,73.4 63.52,73.41 83.31,73.41 83.87,73.41 89.41,73.41 91.67,71.14 91.67,65.79 COMP.2 | 86.36,6.63 12/24V.2 | D1.A 32.84,16.95 | U1.38 46.45,41.63 47.42,42.6 U1.G.1 | v72.34,14.28 74.42,14.28 76.1,15.95 84.91,15.95 85.22,15.64 C2.2 | 63.75,73.4 63.52,73.4 | 26.01,73.4 31.77,73.4 44.12,73.4 62.99,73.4 63.52,73.4 | 26.01,73.4 20.27,73.4 11.25,73.4 10.16,72.31 SL1.6 | U1.15 v53.98,60.83 | 26.01,73.4 v26.01,69.47 | IC6.5 42.42,22.07 42.7,22.35 45.36,22.35 45.82,21.89 IC6.3 | SV1.6 C12.2 C7.2 | 56.79,41.66 U1.1 56.76,38.92 v56.77,38.91
  Top 1.016: 63.15,11.46 63.15,13.66 62.43,14.38 58.62,14.38 57.13,15.87 LM11173.3.1 | D5.A 88.51,53.31 FAN.2 | D4.A 88.51,43.16 SOL3.2 | D3.A 88.51,32.99 SOL2.2 | D2.A 88.51,22.84 SOL1.2 | D6.A v87.63,63.7 | SV1.6 | 35.64,14.48 35.72,14.4 | C4.2 35.72,13.97 | 63.15,11.46 63.13,11.48 61.9,11.48 C5.2 | C6.- 63.15,11.46 | C2.2 86.36,12.83 86.36,6.63
  Top 1.27: 86.36,6.63 86.36,3.81 84.84,2.29 75.97,2.29 | C6.- 63.15,2.29 | 63.15,2.29 75.97,2.29 | 63.15,2.29 v54.86,2.29 36.02,2.29 35.72,2.58 C3.- 35.72,13.97 35.72,14.4 35.72,16.92 | 12/24V.2 91.08,6.6 97.18,12.7 97.18,22.94 | 97.18,22.94 97.18,33.07 | 97.18,33.07 97.18,43.2 | 97.18,43.2 97.18,53.29 | FAN.2 97.16,53.31 97.18,53.29 | 97.18,53.29 97.36,53.11 97.36,62.36 96.24,63.48 COMP.2 | SOL3.2 97.13,43.16 97.18,43.2 | SOL2.2 97.1,32.99 97.18,33.07 | SOL1.2 97.08,22.84 97.18,22.94 | IC6.5 38.96,20.17 35.72,16.92 | C1.- 75.97,2.29 | D1.A 33.83,16.92 35.72,16.92
  Route2 0.508: SG1.- v15.44,48.36
  Route2 0.813: v26.01,69.47 26.01,66.65 23.75,64.39 SG1.-
  Route15 0.508: R23.1 68.33,68.02 68.15,67.84 | 68.15,67.84 63.73,67.84 62.99,68.58 R24.1 | 68.15,67.84 71.78,67.84 72.16,68.22 72.16,70.16 72.67,70.66 R25.2
  Route15 0.762: 61.14,69.85 R24.1
  Route15 0.813: v53.98,60.83 57.28,60.83 59.61,63.17 59.61,68.33 61.14,69.85
  Bottom 0.762: U1.G.19 U1.G.14 49.26,43.96 54.3,38.91 v56.77,38.91 56.77,29.59 54.86,27.69 | U1.G.16 U1.G.17
  Bottom 0.813: v72.92,54.38 v72.92,47.7 v72.92,37.54 v72.92,27.86 72.92,14.86 v72.34,14.28 | SV1.15 SV1.16 | SV1.5 SV1.6 SV1.4 SV1.3 | U1.G.21 U1.G.16 | U1.G.18 U1.G.19 | U1.G.18 U1.G.13 | U1.G.13 U1.G.11 | U1.G.16 U1.G.11 | U1.G.21 U1.G.22 | U1.G.22 U1.G.20 | U1.G.21 U1.G.18 | U1.G.19 U1.G.20 | U1.G.17 U1.G.12 | U1.G.11 U1.G.12 | U1.G.12 U1.G.15 | U1.G.15 U1.G.20 | U1.G.17 U1.G.20 | U1.G.16 U1.G.13 | U1.G.11 U1.G.14 | U1.G.14 U1.G.12 | U1.G.14 U1.G.16 | U1.G.14 U1.G.17 | U1.G.15 U1.G.17 | U1.G.19 U1.G.17 | U1.G.16 U1.G.19 | U1.G.16 U1.G.18 | U1.G.21 U1.G.19 | U1.G.19 U1.G.22
  Bottom 1.016: v54.86,2.29 54.86,26.49 | 54.86,27.69 54.86,26.49 | COMP.2 92.69,64.77 88.7,64.77 v87.63,63.7 | SV1.6 21.72,27.71 22.94,26.49 34.44,26.49 | 54.86,26.49 34.44,26.49 | 34.44,26.49 34.44,30.12 SV1.16
  other vias: 73.58,70.66
MISO  (via drill 0.35)
  Top 0.406: v49.78,62.33 57.25,62.33 58.14,63.22 2.2"TFT.1 | v44.55,50.55 44.52,50.52 U1.31
  Route2 0.254: v44.6,38.43 44.55,38.48 v44.55,50.55
  Route2 0.406: v49.78,62.33 49.78,54.71 47.4,52.32 46.33,52.32 v44.55,50.55
  Route15 0.254: v44.6,38.43 39.93,38.43 39.5,38 SV1.19
MOSI  (via drill 0.35)
  Top 0.406: v43.59,63.83 51.28,63.83 52.14,64.69 2.2"TFT.4 | v43.08,42.9 U1.37 v37.82,42.9
  Route2 0.254: SV1.17 36.96,35.48 36.96,35.49 36.96,42.9 v37.82,42.9
  Route2 0.406: v43.59,63.83 43.33,63.58 43.33,46.63 43.08,46.38 v43.08,42.9
N$1
  Top 0.406: K1.2 72.9,19.05 72.48,19.47 72.48,20.49 71.5,21.46 R6.1
N$2
  Top 0.406: K2.2 72.64,29.21 72.22,29.63 72.22,32.55 R7.1
N$3
  Top 0.406: R12.1 78.61,30.61 80.01,29.21 K2.3
  Top 0.508: D3.C 87.63,28.07 87.53,27.96
  Top 1.016: K2.3 85.09,29.21 86.33,27.96 87.53,27.96 SOL2.1
N$4
  Top 0.406: LED2.C 74.19,35.56 74.59,35.16 K2.1
N$5
  Top 0.406: LED1.C 73.08,25.25 73.08,24.36 73.08,23.95 73.36,23.67 74.02,23.67 74.59,23.1 K1.1
N$6
  Top 0.406: R2.2 65.66,30.88 T2.1
N$7
  Top 0.406: T2.2 64.82,29.21 64.26,29.77 64.26,34.9 64.77,35.41 67.77,35.41 68.2,34.98 R7.2
N$8
  Top 0.406: LED3.C 74.07,45.72 74.59,45.2 K3.1
N$9
  Top 0.406: R11.1 78.61,20.35 79.91,19.05 K1.3
  Top 0.508: D2.C 87.63,17.88 87.55,17.8
  Top 1.016: K1.3 85.09,19.05 86.33,17.8 87.55,17.8 SOL1.1
N$10
  Top 0.406: LED4.C 73.05,56.01 74.22,56.01 74.59,55.64 K4.1
N$11
  Top 0.406: R12.2 82.96,35.56 83.82,34.7 LED7.A
N$12
  Top 0.406: R8.1 71,40.71 72.34,39.37 K3.2
N$13
  Top 0.254: R1.2 66.06,24.23 66.06,23.06 66.29,22.84 67.16,22.84 67.49,22.5 67.49,14.38 T1.1
N$14
  Top 0.406: R13.1 78.61,40.74 79.98,39.37 K3.3
  Top 0.508: D4.C 87.68,38.95 87.68,38.12
  Top 1.016: K3.3 85.09,39.37 86.33,38.12 87.68,38.12 SOL3.1
N$15
  Top 0.406: R3.2 65.84,42.5 T3.1
N$16
  Top 0.406: T3.2 64.85,38.1 64.26,38.68 64.26,43.75 64.76,44.25 67.79,44.25 68.2,43.84 R8.2
N$17
  Top 0.254: R6.2 69.72,24.39 69.72,25.43 69.06,26.09 65.08,26.09 64.01,25.02 64.01,20.83 66.22,18.62 66.22,13.74 67.21,12.75 68.78,12.75 69.09,13.06 T1.2
N$19
  Top 0.406: J3.VBUS 7.7,59.21 L3.1
N$20
  Top 0.406: R16.2 25.78,42.77 SG1.+
N$21
  Top 0.406: T5.1 65.66,57.55 R5.2
N$22
  Top 0.406: T5.2 66.04,55.83 64.82,55.83 64.26,56.39 64.26,61.21 64.92,61.87 67.64,61.87 68.2,61.32 R10.2
N$23
  Top 0.254: R17.2 23.11,56.97 23.8,56.29 28.78,56.29 29.67,57.17 T6.4
N$25
  Top 0.254: R26.1 27.07,61.09 27.74,60.43 29.64,60.43 T6.2
N$26
  Top 0.406: R9.1 71,50.09 71.63,49.45 74.51,49.45 K4.2
N$27
  Top 0.406: LED10.A 83.74,64.21 83.74,64.9 83.29,65.35 81.74,65.35 R15.2
N$28
  Top 0.406: R11.2 82.96,25.4 83.82,24.54 LED6.A
N$29
  Top 0.406: K5.1 74.59,64.4 73.97,65.02 LED5.C
N$30
  Top 0.406: R13.2 82.93,45.72 83.82,44.83 LED8.A
N$31
  Top 0.406: K5.2 72.64,59.69 72.14,60.2 R10.1
N$32
  Top 0.406: R14.1 78.61,50.68 79.76,49.53 K4.3
  Top 0.508: D5.C 87.76,49.03 87.76,48.28
  Top 1.016: K4.3 84.84,49.53 86.08,48.28 87.76,48.28 FAN.1
N$33
  Top 0.406: R4.2 65.66,48.66 T4.1
N$34
  Top 0.406: T4.2 64.64,46.99 64.29,47.35 64.29,52.73 64.82,53.26 67.72,53.26 68.2,52.78 R9.2
N$36
  Top 0.406: J3.GND 7.7,56.61 L4.1
N$37
  Top 0.254: R14.2 81.59,55.7
  Top 0.406: 81.59,55.7 83.01,55.7 83.82,54.89 LED9.A
N$38  (1 unrouted)
  Top 0.254: J3.SHIELD6 3.17,55.31 J3.SHIELD4
  Top 0.406: J3.SHIELD2 6.53,55.01 7.58,55.01 L2.1
  Top 0.508: 5.95,60.64 J3.SHIELD 5.89,60.59 3.17,60.59 | 3.27,56.85 J3.SHIELD4 J3.SHIELD3 3.17,60.59 | 6.33,55.21 6.53,55.01 | J3.SHIELD8 3.17,60.59 | J3.SHIELD6 5.92,55.21 J3.SHIELD2
  Bottom 0.254: J3.SHIELD5 J3.SHIELD7 4.65,55.18 4.95,55.48 J3.SHIELD10 J3.SHIELD9 4.88,60.34 4.58,60.64 J3.SHIELD5
  Bottom 0.508: J3.SHIELD5 3.61,60.34
N$40
  Top 0.305: J3.D- 7.12,58.56 7.26,58.43 11.52,58.43 12.31,57.65 15.72,57.65 15.9,57.47 15.9,57.46 16.05,57.3 16.05,55.98 15.82,55.75 U$1.6
N$41
  Top 0.305: U$1.5 12.06,57.02 11.18,57.91 J3.D+
O2-CONC  (via drill 0.35)
  Top 0.406: U1.4 59.41,45.44 v59.44,45.47
  Route15 0.254: SV1.14 31.88,28.93 32.38,28.42 53.98,28.42 58.88,33.33 58.88,39.26 60.86,41.24 60.86,45.01 60.4,45.47 v59.44,45.47
  Route15 0.406: v59.44,45.47 54.72,45.45 53.24,46.94 53.24,52.88 50.32,55.8 50.32,59.92 49.48,60.76 43.2,60.76 37.57,66.4 14.12,66.4 12.7,67.82 SL1.5
OUT
  Top 1.27: IC6.2 47.52,22.94 45.8,24.66 34.65,24.66 29.23,19.25 | 29.23,19.25 22.35,19.25 21.18,18.09 L1.1 | D1.C 29.01,19.03 29.23,19.25
RL1  (via drill 0.35)
  Top 0.406: U1.8 59.41,50.52 v59.44,50.55
  Route2 0.254: SV1.22 45.21,26.98 53.34,26.98 55.27,28.91 55.27,50.19 55.63,50.55 v59.44,50.55 60.48,50.55 61.47,49.55 61.47,33.05 64.19,30.33 64.19,22.07 64.82,21.44 66.02,21.44 R1.1
  other vias: 66.04,21.46
RL2  (via drill 0.35)
  Top 0.406: U1.9 59.41,51.79 v59.44,51.82
  Route2 0.254: SV1.24 47.35,27.38 53.17,27.38 54.79,29 54.79,51.46 55.14,51.82 v59.44,51.82 63.68,51.82 63.86,51.64 63.86,45.7 62.13,43.97 62.13,41.96 62.86,41.23 R2.1
  other vias: 62.86,33.78
RL3  (via drill 0.35)
  Top 0.406: U1.10 59.41,53.06 v59.44,53.09 | R3.1 62.92,42.62 62.92,42.14 62.86,42.19 R3.1
  Route2 0.254: v59.44,53.09 54.91,53.09 54.33,52.5 54.33,29.12 53,27.79 48.92,27.79 47.12,29.59 SV1.26
  Route2 0.406: v59.44,53.09 63.93,53.09 64.67,52.35 64.67,45.29 62.86,43.48 R3.1
  other vias: 62.86,42.67
RL4  (via drill 0.35)
  Top 0.406: U1.11 56.79,54.36 v59.44,54.36 62.26,54.36 62.86,53.75 R4.1
  Route2 0.254: v59.44,54.36 54.41,54.36 53.9,53.85 53.9,29.26 52.83,28.19 51.05,28.19 49.66,29.59 SV1.28
RL5  (via drill 0.35)
  Top 0.406: U1.12 59.41,55.6 v59.44,55.63 59.44,59.28 60.35,60.2 R5.1
  Route2 0.254: v59.44,55.63 53.98,55.63 53.42,55.07 53.42,31.37 SV1.30
RST0  (via drill 0.35)
  Top 0.406: v48.41,55.68 42.98,55.68 41.79,56.87 U1.26 | 2.2"TFT.6 48.14,66.01 v48.41,65.73
  Route2 0.406: v48.41,65.73 v48.41,55.68
RTS
  Top 0.254: U$1.14 21.08,59.56 21.59,60.07 21.59,62.66 22.3,63.37 31.65,63.37 32.08,62.94 32.08,59.46 31.55,58.93 T6.3 27.84,58.93 27.2,58.29 R26.2
RX0  (via drill 0.35)
  Top 0.254: 14.88,60.78 17.48,60.78 18.62,59.64 18.62,42.39 23.5,37.52 29.44,37.52 30.61,36.35 v30.61,34.95
  Top 0.406: U$1.2 14.88,60.78
  Top 0.508: U1.34 v37.49,46.71
  Route2 0.254: v30.61,34.95 35.23,34.95 35.66,35.38 35.66,45.97 36.4,46.71 v37.49,46.71
  Route15 0.254: v30.61,34.95 30.61,31.42 SV1.12
RX1  (via drill 0.35)
  Top 0.508: U1.27 v37.54,55.6
  Route2 0.406: UART.2 7.82,15.67 14.25,22.1 14.25,33.53 15.52,34.8 23.42,34.8 23.85,35.23 23.85,37.08 25.02,38.25 28.3,38.25 29.34,37.21 SV1.11 29.34,36.07 34.04,36.07 34.7,36.73 34.7,53.9 36.4,55.6 v37.54,55.6
SCL  (via drill 0.35)
  Top 0.406: v41.45,44.15 41.43,44.17 U1.36
  Top 0.508: v33.33,44.25 39.68,44.25 U1.36
  Route2 0.254: v41.45,44.15 41.45,39.9 40.62,39.06 39.37,39.06 38.2,37.9 38.2,31.39 SV1.18
  Route2 0.406: v41.45,44.15 41.45,56.51 41.15,56.82 41.15,61.87 34.29,68.73 OXY-SENSE.3
  Route15 0.406: J1.4 8.53,25.4 | J4.4 8.53,25.38 8.53,25.4 | U$4.3 9.55,41.91 8.53,40.89 8.53,25.4
  Route15 0.508: U$4.3 14.76,41.91 16.05,43.2 32.33,43.2 33.35,44.22 v33.33,44.25
SDA  (via drill 0.35)
  Top 0.406: v42.32,47.95 39.78,47.95 U1.33
  Top 0.508: v33.25,47.98 U1.33 39.78,47.95
  Route2 0.254: v42.32,47.95 42.32,39.83 40.77,38.28 40.77,31.42 SV1.20
  Route2 0.406: v42.32,47.95 42.32,56.44 41.71,57.05 41.71,62.46 36.83,67.33 OXY-SENSE.4 | J1.3 6.81,27.94 | J4.3 6.81,27.91 6.81,27.94 | U$4.4 8.36,44.45 6.81,42.9 6.81,27.94
  Route15 0.508: U$4.4 32.05,44.45 33.27,45.67 33.27,47.98 v33.25,47.98
TEMP1  (via drill 0.35)
  Top 0.406: U1.6 59.41,47.98 v59.44,48.01 | v68.33,63.75 70.23,63.75 70.49,64.01 70.49,65.68 R20.2 70.49,67.62 70.87,68 R23.2
  Route15 0.406: v68.33,63.75 68.33,49.96 66.37,48.01 v59.44,48.01
TEMP2  (via drill 0.35)
  Top 0.406: U1.7 59.41,49.25 v59.44,49.28 | v65.79,63.75 64.9,64.64 64.9,65.84 R22.2 64.9,67.47 65.53,68.1 R24.2
  Route15 0.406: v65.79,63.75 65.79,51.05 64.01,49.28 v59.44,49.28
TX0  (via drill 0.35)
  Top 0.254: U$1.3 17.27,59.56 17.91,58.93 17.91,42.09 23.19,36.8 25.55,36.8 v25.55,36.83
  Top 0.508: U1.35 v37.54,45.44
  Route2 0.254: v37.54,45.44 36.42,44.32 36.42,34.85 35.66,34.09 35.66,31.77 35.31,31.42 27.99,31.42 26.8,30.23 SV1.10 25.55,31.39 v25.55,36.83
TX1  (via drill 0.35)
  Top 0.508: U1.28 v37.54,54.33
  Route15 0.406: UART.3 5.79,19.2 11.35,19.2 14.25,22.1 14.25,33.48 15.52,34.75 26.8,34.75 | SV1.9 26.8,34.75 | 26.8,34.75 28.12,36.07 34.01,36.07 34.7,36.75 34.7,52.68 36.34,54.33 v37.54,54.33